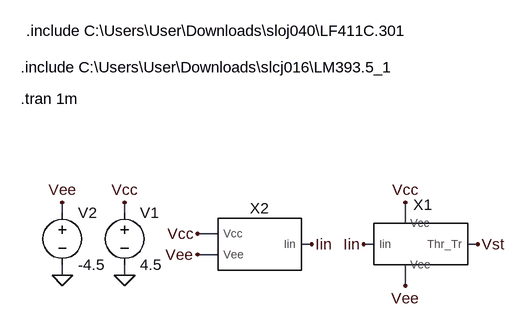
[diagram p0: schematic classD.asc]
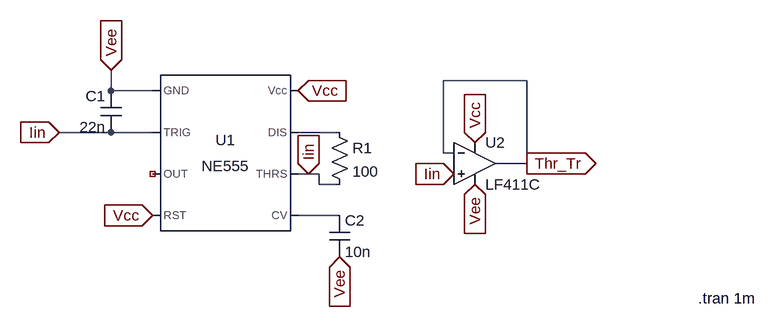
[diagram p1: sub-circuit 555.asc]
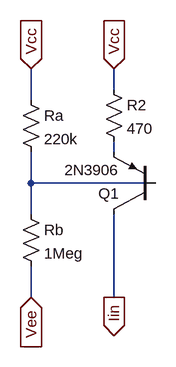
[diagram p2: sub-circuit current_supply.asc]
classD.asc, the LTspice schematic file:
Version 4
SHEET 1 880 680
WIRE -144 112 -144 96
WIRE -48 112 -48 96
WIRE 384 128 384 96
WIRE 96 144 64 144
WIRE 240 160 224 160
WIRE 336 160 320 160
WIRE 496 160 480 160
WIRE 96 176 64 176
WIRE -144 208 -144 192
WIRE -48 208 -48 192
WIRE 384 224 384 192
FLAG -48 208 0
FLAG 384 96 Vcc
FLAG -48 96 Vcc
FLAG 64 144 Vcc
FLAG 240 160 Iin
FLAG 320 160 Iin
FLAG -144 208 0
FLAG -144 96 Vee
FLAG 384 224 Vee
FLAG 64 176 Vee
FLAG 496 160 Vst
SYMBOL voltage -48 96 R0
WINDOW 123 0 0 Left 0
WINDOW 39 0 0 Left 0
SYMATTR InstName V1
SYMATTR Value 4.5
SYMBOL 555 384 160 R0
SYMATTR InstName X1
SYMBOL voltage -144 96 R0
WINDOW 123 0 0 Left 0
WINDOW 39 0 0 Left 0
SYMATTR InstName V2
SYMATTR Value -4.5
SYMBOL current_supply 160 160 R0
SYMATTR InstName X2
TEXT -208 -112 Left 2 !.include C:\\Users\\User\\Downloads\\slcj016\\LM393.5_1
TEXT -200 -168 Left 2 !.include C:\\Users\\User\\Downloads\\sloj040\\LF411C.301
TEXT -208 -64 Left 2 !.tran 1m

555.asc, the sub-circuit schematic file:
Version 4
SHEET 1 1072 680
WIRE 704 48 576 48
WIRE 64 64 64 32
WIRE 128 64 64 64
WIRE 64 128 -16 128
WIRE 128 128 64 128
WIRE 416 128 352 128
WIRE 576 160 576 48
WIRE 592 160 576 160
WIRE 704 176 704 48
WIRE 704 176 656 176
WIRE 368 192 352 192
WIRE 384 192 368 192
WIRE 384 208 384 192
WIRE 416 208 384 208
WIRE 416 256 352 256
FLAG 352 64 Vcc
IOPIN 352 64 In
FLAG 128 256 Vcc
IOPIN 128 256 In
FLAG -16 128 Iin
IOPIN -16 128 In
FLAG 64 32 Vee
IOPIN 64 32 In
FLAG 624 144 Vcc
IOPIN 624 144 In
FLAG 624 208 Vee
IOPIN 624 208 In
FLAG 704 176 Thr_Tr
IOPIN 704 176 Out
FLAG 368 192 Iin
IOPIN 368 192 In
FLAG 592 192 Iin
IOPIN 592 192 In
FLAG 416 320 Vee
IOPIN 416 320 In
SYMBOL Misc\\NE555 240 160 R0
SYMATTR InstName U1
SYMBOL res 400 112 R0
SYMATTR InstName R1
SYMATTR Value 100
SYMBOL cap 80 128 R180
WINDOW 0 24 56 Left 2
WINDOW 3 24 8 Left 2
SYMATTR InstName C1
SYMATTR Value 22n
SYMBOL cap 400 256 R0
SYMATTR InstName C2
SYMATTR Value 10n
SYMBOL OpAmps\\opamp2 624 112 R0
SYMATTR InstName U2
SYMATTR Value LF411C
TEXT 968 384 Left 2 !.tran 1m

current_supply.asc, the sub-circuit schematic file:
Version 4
SHEET 1 880 680
WIRE 256 0 256 -32
WIRE 128 16 128 -32
WIRE 256 96 256 80
WIRE 128 144 128 96
WIRE 320 144 128 144
WIRE 128 192 128 144
WIRE 128 320 128 272
WIRE 256 320 256 192
FLAG 256 -32 Vcc
IOPIN 256 -32 In
FLAG 128 -32 Vcc
IOPIN 128 -32 In
FLAG 256 320 Iin
IOPIN 256 320 Out
FLAG 128 320 Vee
IOPIN 128 320 In
SYMBOL res 240 -16 R0
SYMATTR InstName R2
SYMATTR Value 470
SYMBOL res 112 176 R0
SYMATTR InstName Rb
SYMATTR Value 1Meg
SYMBOL res 112 0 R0
SYMATTR InstName Ra
SYMATTR Value 220k
SYMBOL pnp 320 192 R180
SYMATTR InstName Q1
SYMATTR Value 2N3906

The netlist it stands for:
* classD.asc
V1 Vcc 0 4.5
XX1 Iin Vcc Vee Vst 555
V2 Vee 0 -4.5
XX2 Vcc Vee Iin current_supply

* block symbol definitions
.subckt 555 Iin Vcc Vee Thr_Tr
XU1 Vee Iin NC_01 Vcc N002 Iin N001 Vcc NE555  ; pins GND TRIG OUT RST CV THRS DIS Vcc
R1 N001 Iin 100
C1 Iin Vee 22n
C2 N002 Vee 10n
XU2 Iin Thr_Tr Vcc Vee Thr_Tr LF411C  ; pins In+ In- V+ V- OUT
.tran 1m
.ends 555

.subckt current_supply Vcc Vee Iin
R2 Vcc N001 470
Rb N002 Vee 1Meg
Ra Vcc N002 220k
Q1 Iin N002 N001 0 2N3906
.ends current_supply

.model NPN NPN
.model PNP PNP
.lib standard.bjt
.include C:\Users\User\Downloads\slcj016\LM393.5_1
.include C:\Users\User\Downloads\sloj040\LF411C.301
.tran 1m
.lib NE555.sub
.backanno
.end